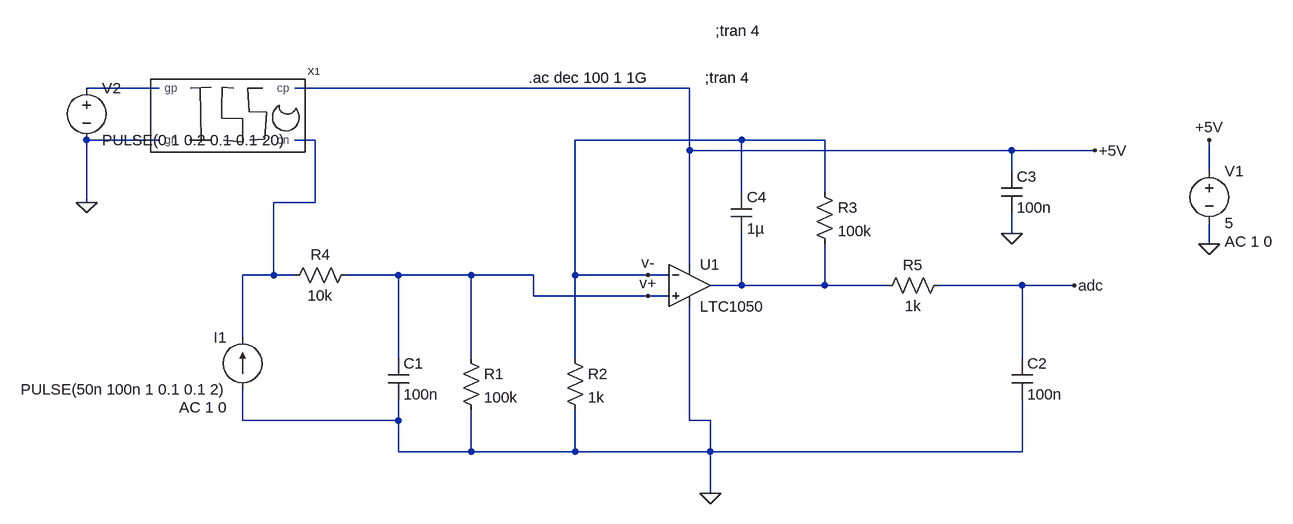
[diagram p0: schematic conditionneur_de_signal_gaz_sensor.asc]
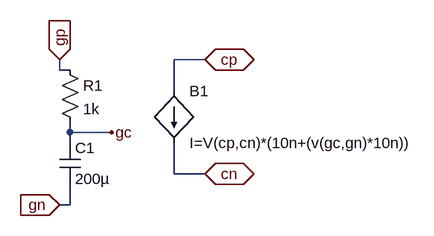
[diagram p1: sub-circuit gas_sensor.asc]
conditionneur_de_signal_gaz_sensor.asc, the LTspice schematic file:
Version 4
SHEET 1 900 692
WIRE -816 48 -928 48
WIRE 0 48 -608 48
WIRE -816 128 -928 128
WIRE -576 128 -608 128
WIRE 80 128 -176 128
WIRE 208 128 80 128
WIRE 0 144 0 48
WIRE 496 144 0 144
WIRE 624 144 496 144
WIRE 496 176 496 144
WIRE 800 176 800 128
WIRE 80 208 80 128
WIRE 208 208 208 128
WIRE -928 224 -928 128
WIRE -576 224 -576 128
WIRE -576 224 -640 224
WIRE 496 272 496 240
WIRE 800 288 800 256
WIRE 0 320 0 144
WIRE -640 336 -640 224
WIRE -640 336 -688 336
WIRE -608 336 -640 336
WIRE -448 336 -528 336
WIRE -336 336 -448 336
WIRE -240 336 -336 336
WIRE -176 336 -176 128
WIRE -64 336 -176 336
WIRE -32 336 -64 336
WIRE 80 352 80 272
WIRE 80 352 32 352
WIRE 208 352 208 288
WIRE 208 352 80 352
WIRE 304 352 208 352
WIRE 512 352 384 352
WIRE 592 352 512 352
WIRE -240 368 -240 336
WIRE -64 368 -240 368
WIRE -32 368 -64 368
WIRE -688 432 -688 336
WIRE -448 464 -448 336
WIRE -336 464 -336 336
WIRE -176 464 -176 336
WIRE 512 464 512 352
WIRE -688 560 -688 512
WIRE -448 560 -448 528
WIRE -448 560 -688 560
WIRE 0 560 0 384
WIRE 32 560 0 560
WIRE -448 608 -448 560
WIRE -336 608 -336 544
WIRE -336 608 -448 608
WIRE -176 608 -176 544
WIRE -176 608 -336 608
WIRE 32 608 32 560
WIRE 32 608 -176 608
WIRE 512 608 512 528
WIRE 512 608 32 608
WIRE 32 672 32 608
FLAG 592 352 adc
FLAG 32 672 0
FLAG 800 288 0
FLAG 800 128 +5V
FLAG 624 144 +5V
FLAG 496 272 0
FLAG -64 336 v-
FLAG -64 368 v+
FLAG -928 224 0
SYMBOL OpAmps\\LTC1050 0 288 R0
SYMATTR InstName U1
SYMBOL res -352 448 R0
SYMATTR InstName R1
SYMATTR Value 100k
SYMBOL res -192 448 R0
SYMATTR InstName R2
SYMATTR Value 1k
SYMBOL res 192 192 R0
SYMATTR InstName R3
SYMATTR Value 100k
SYMBOL res -512 320 R90
WINDOW 0 0 56 VBottom 2
WINDOW 3 32 56 VTop 2
SYMATTR InstName R4
SYMATTR Value 10k
SYMBOL res 400 336 R90
WINDOW 0 0 56 VBottom 2
WINDOW 3 32 56 VTop 2
SYMATTR InstName R5
SYMATTR Value 1k
SYMBOL cap -464 464 R0
SYMATTR InstName C1
SYMATTR Value 100n
SYMBOL cap 496 464 R0
SYMATTR InstName C2
SYMATTR Value 100n
SYMBOL cap 480 176 R0
SYMATTR InstName C3
SYMATTR Value 100n
SYMBOL cap 64 208 R0
SYMATTR InstName C4
SYMATTR Value 1µ
SYMBOL voltage 800 160 R0
WINDOW 123 24 124 Left 2
WINDOW 39 0 0 Left 0
SYMATTR Value2 AC 1 0
SYMATTR InstName V1
SYMATTR Value 5
SYMBOL current -688 512 R180
WINDOW 0 24 80 Left 2
WINDOW 3 24 0 Left 2
WINDOW 123 24 -28 Left 2
WINDOW 39 0 0 Left 0
SYMATTR InstName I1
SYMATTR Value PULSE(50n 100n 1 0.1 0.1 2)
SYMATTR Value2 AC 1 0
SYMBOL gas_sensor -704 96 R0
SYMATTR InstName X1
SYMBOL voltage -928 32 R0
WINDOW 123 0 0 Left 0
WINDOW 39 0 0 Left 0
SYMATTR InstName V2
SYMATTR Value PULSE(0 1 0.2 0.1 0.1 20)
TEXT 24 32 Left 2 !;tran 4
TEXT 40 -40 Left 2 !;tran 4
TEXT -248 32 Left 2 !.ac dec 100 1 1G

gas_sensor.asc, the sub-circuit schematic file:
Version 4
SHEET 1 880 680
WIRE 288 80 240 80
WIRE 64 96 64 80
WIRE 80 96 64 96
WIRE 240 128 240 80
WIRE 80 192 80 176
WIRE 144 192 80 192
WIRE 80 208 80 192
WIRE 240 256 240 208
WIRE 288 256 240 256
WIRE 80 304 80 272
WIRE 80 304 64 304
FLAG 64 80 gp
IOPIN 64 80 In
FLAG 64 304 gn
IOPIN 64 304 In
FLAG 288 80 cp
IOPIN 288 80 BiDir
FLAG 288 256 cn
IOPIN 288 256 BiDir
FLAG 144 192 gc
SYMBOL cap 64 208 R0
SYMATTR InstName C1
SYMATTR Value 200µ
SYMBOL res 64 80 R0
SYMATTR InstName R1
SYMATTR Value 1k
SYMBOL bi 240 128 R0
SYMATTR InstName B1
SYMATTR Value I=V(cp,cn)*(10n+(v(gc,gn)*10n))

The netlist it stands for:
* conditionneur_de_signal_gaz_sensor.asc
XU1 v+ v- +5V 0 N003 LTC1050  ; pins In+ In- V+ V- OUT
R1 v+ 0 100k
R2 v- 0 1k
R3 v- N003 100k
R4 v+ N002 10k
R5 adc N003 1k
C1 v+ 0 100n
C2 adc 0 100n
C3 +5V 0 100n
C4 v- N003 1µ
V1 +5V 0 5 AC 1 0
I1 0 N002 PULSE(50n 100n 1 0.1 0.1 2) AC 1 0
XX1 N001 0 +5V N002 gas_sensor
V2 N001 0 PULSE(0 1 0.2 0.1 0.1 20)

* block symbol definitions
.subckt gas_sensor gp gn cp cn
C1 gc gn 200µ
R1 gp gc 1k
B1 cp cn I=V(cp,cn)*(10n+(v(gc,gn)*10n))
.ends gas_sensor

;tran 4
;tran 4
.ac dec 100 1 1G
.lib LTC.lib
.backanno
.end